# Altium schematic sheet 12_Supply.SchDoc: 12V Supply
size Tabloid; DocumentNumber: LM-008; Revision: B; SheetNumber: 4; SheetTotal: 7
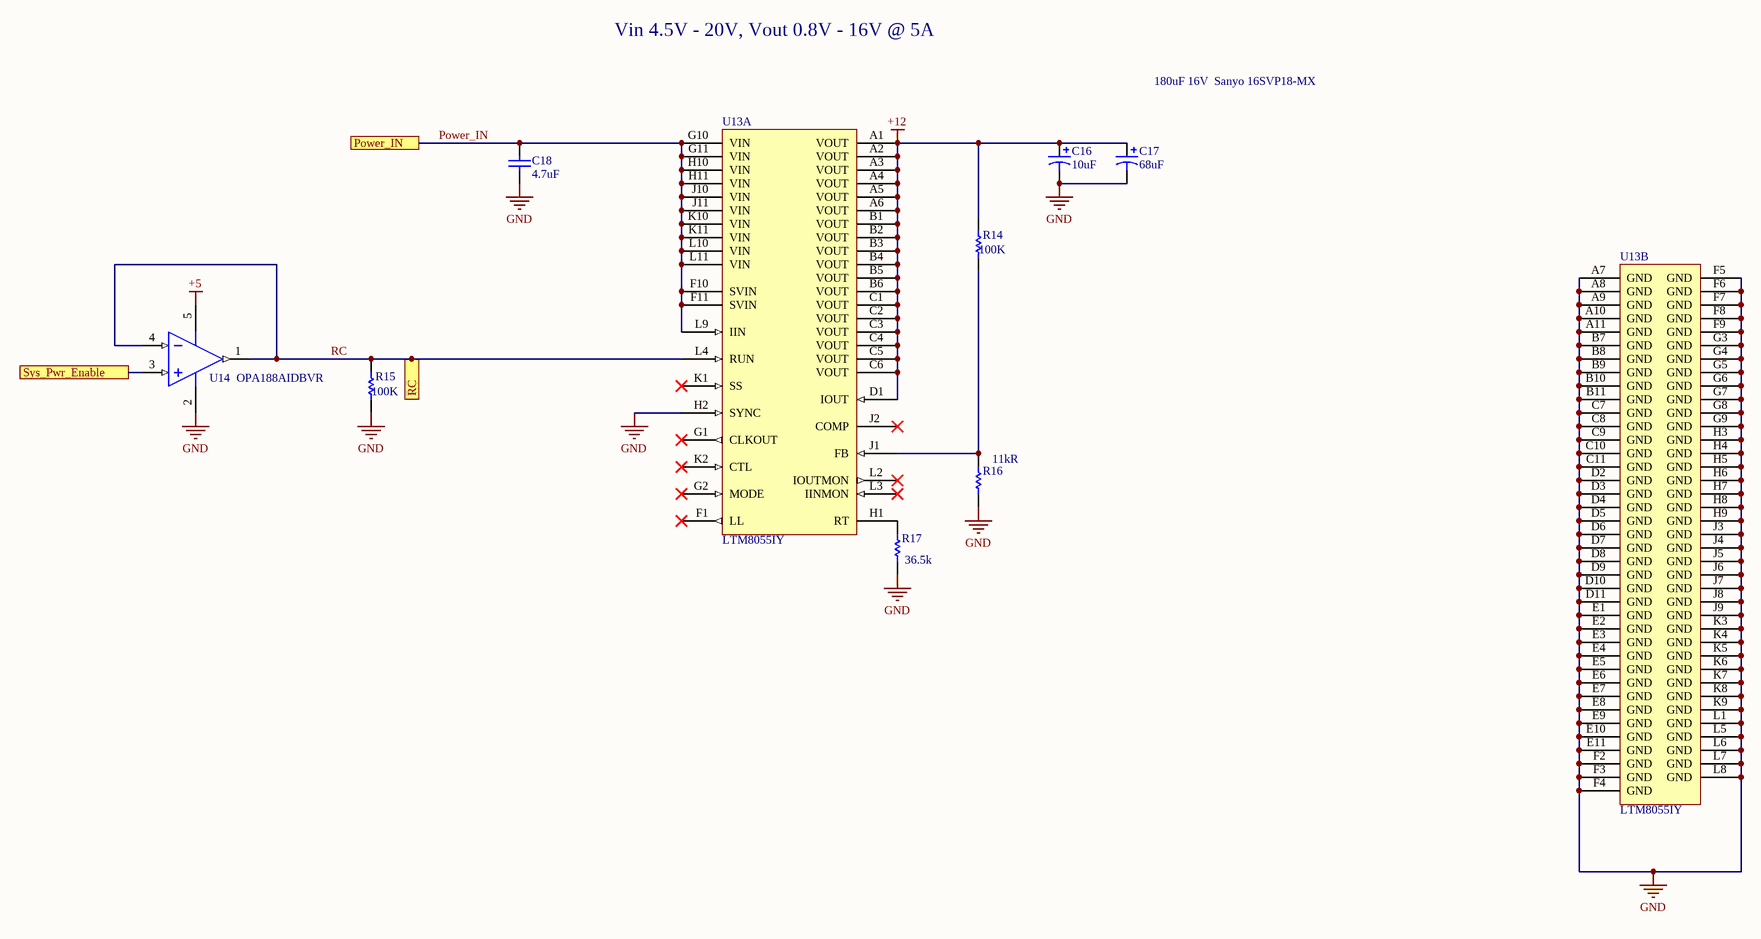
[diagram p0: 12_Supply.SchDoc]

## Parts
C16  10uF  [C0805]
C17  68uF  [AVX-CAPC7343_V]
C18  4.7uF  [CAPC1210(3225)100_M]
R14  Resistance: 100K  [RESC0805(2012)_M]  (hidden comment: RES SMD 100K OHM 1% 1/8W 0805)
R15  Resistance: 100K  [RESC0805(2012)_M]  (hidden comment: RES SMD 100K OHM 1% 1/8W 0805)
R16  Resistance: 11kR  [RESC0805(2012)_M]  (hidden comment: RES SMD 11K OHM 1% 1/8W 0805)
R17  Resistance: 36.5k  [RESC0805(2012)_M]  (hidden comment: RES SMD 35K OHM 1% 1/8W 0805)
U13  LTM8055IY  [LT-BGA-121-15000X15000X4920]  (parts A,B of 2)
U14  OPA188AIDBVR  [DBV0005A_M]

## Ports
Power_IN, RC, Sys_Pwr_Enable

## Nets
+5: U14.5(V+)
+12: C16.1 C17.1 R14.1 U13.A1(VOUT) U13.A2(VOUT) U13.A3(VOUT) U13.A4(VOUT) U13.A5(VOUT) U13.A6(VOUT) U13.B1(VOUT) U13.B2(VOUT) U13.B3(VOUT) U13.B4(VOUT) U13.B5(VOUT) U13.B6(VOUT) U13.C1(VOUT) U13.C2(VOUT) U13.C3(VOUT) U13.C4(VOUT) U13.C5(VOUT) U13.C6(VOUT) U13.D1(IOUT)
GND: C16.2 C17.2 C18.1 R15.2 R16.2 R17.2 U13.A7(GND) U13.A8(GND) U13.A9(GND) U13.A10(GND) U13.A11(GND) U13.B7(GND) U13.B8(GND) U13.B9(GND) U13.B10(GND) U13.B11(GND) U13.C7(GND) U13.C8(GND) U13.C9(GND) U13.C10(GND) U13.C11(GND) U13.D2(GND) U13.D3(GND) U13.D4(GND) U13.D5(GND) U13.D6(GND) U13.D7(GND) U13.D8(GND) U13.D9(GND) U13.D10(GND) U13.D11(GND) U13.E1(GND) U13.E2(GND) U13.E3(GND) U13.E4(GND) U13.E5(GND) U13.E6(GND) U13.E7(GND) U13.E8(GND) U13.E9(GND) U13.E10(GND) U13.E11(GND) U13.F2(GND) U13.F3(GND) U13.F4(GND) U13.F5(GND) U13.F6(GND) U13.F7(GND) U13.F8(GND) U13.F9(GND) U13.G3(GND) U13.G4(GND) U13.G5(GND) U13.G6(GND) U13.G7(GND) U13.G8(GND) U13.G9(GND) U13.H2(SYNC) U13.H3(GND) U13.H4(GND) U13.H5(GND) U13.H6(GND) U13.H7(GND) U13.H8(GND) U13.H9(GND) U13.J3(GND) U13.J4(GND) U13.J5(GND) U13.J6(GND) U13.J7(GND) U13.J8(GND) U13.J9(GND) U13.K3(GND) U13.K4(GND) U13.K5(GND) U13.K6(GND) U13.K7(GND) U13.K8(GND) U13.K9(GND) U13.L1(GND) U13.L5(GND) U13.L6(GND) U13.L7(GND) U13.L8(GND) U14.2(V-)
Power_IN: C18.2 U13.F10(SVIN) U13.F11(SVIN) U13.G10(VIN) U13.G11(VIN) U13.H10(VIN) U13.H11(VIN) U13.J10(VIN) U13.J11(VIN) U13.K10(VIN) U13.K11(VIN) U13.L9(IIN) U13.L10(VIN) U13.L11(VIN) ; port Power_IN
RC: R15.1 U13.L4(RUN) U14.1(OUT) U14.4(IN-) ; port RC
Sys_Pwr_Enable: U14.3(IN+) ; port Sys_Pwr_Enable
NetR14_2: R14.2 R16.1 U13.J1(FB)
NetR17_1: R17.1 U13.H1(RT)

Not connected (* = marked no-connect by the designer): U13 F1(LL)* G1(CLKOUT)* G2(MODE)* J2(COMP)* K1(SS)* K2(CTL)* L2(IOUTMON)* L3(IINMON)*

## Notes on the sheet
- Vin 4.5V - 20V, Vout 0.8V - 16V @ 5A
- 180uF 16V  Sanyo 16SVP18-MX
- Title
- Size:
- Date:
- Tabloid
- Number:
- Time:
- Revision:
- Sheet
- of
- ZLS Corporation
- 7801 North Lamar Blvd.
- Suite E-184
- Austin, Texas 78752  USA
- (512) 453-0288
- File:

## Library data of the parts
C16 = Cap Pol3: Polarized Capacitor (Surface Mount)
C17 = CMP-0279-00002-2: CAP TANT POLY 68UF 25V 2917; Manufacturer: Kyocera AVX; Manufacturer Part Number: TCJE686M025R0050; Tolerance: 20%; ESR (Equivalent Series Resistance): 50mR; Leakage Current: 170uA; Life (Hours): 2000Hour; Dissipation Factor: 6%; ComponentLink2Description: Datasheet; ComponentLink2URL: http://www.avx.com/docs/Catalogs/taj.pdf; ComponentLink1URL: http://www.avx.com/; ComponentLink1Description: Manufacturer URL; Supplier 1: Digi-Key; Supplier Part Number 1: 478-9471-6-ND; Stock 1: 439; Pricing 1: 1=3.92, 10=3.163, 100=2.4672 (USD); Mount: Surface Mount; Case/Package: 2917; Case Code (Imperial): 2917; Case Code (Metric): 7343; Min Operating Temperature: -55°C; Max Operating Temperature: 105°C; Capacitance: 68uF; Voltage Rating: 25V; Packaging: Tape and Reel; Package Quantity: 400; Voltage Rating (DC): 25V; Termination: SMD/SMT; Features: General Purpose; Length: 7.3mm; Height: 4.3mm; Width: 0.169inch; Height - Seated (Max): 0.169inch; Depth: 4.3mm; Radiation Hardening: No; ComponentLink3URL: http://www.avx.com/docs/catalogs/tcj.pdf?src-supplier=Avnet; ComponentLink3Description: http://www.avx.com/docs/catalogs/tcj.pdf?src-supplier=Avnet
C18 = CMP-1038-00619-1: CAP CER 4.7UF 50V X7R 1210; Manufacturer: Murata; Manufacturer Part Number: GCM32ER71H475KA55K; Tolerance: 10%; Supplier 1: Digi-Key; Supplier Part Number 1: 490-8066-6-ND; Stock 1: 63504; Pricing 1: 1=1.8, 10=1.424, 100=1.0676, 500=0.80666, 1000=0.71177 (USD); Mount: Surface Mount; Case/Package: 1210; Case Code (Metric): 3225; Case Code (Imperial): 1210; Min Operating Temperature: -55°C; Max Operating Temperature: 125°C; Capacitance: 4.7uF; Packaging: Tape and Reel; Package Quantity: 1; Voltage Rating: 50V; Voltage Rating (DC): 50V; Dielectric: X7R; Termination: SMD/SMT; Length: 3.2mm; Height: 2.5mm; Width: 0.098inch; Thickness: 0.106inch; Depth: 2.5mm; Ratings: AEC-Q200; Radiation Hardening: No; ComponentLink1URL: http://search.murata.co.jp/Ceramy/image/img/A01X/partnumbering_e_02.pdf?src-supplier=Digi-Key; ComponentLink1Description: http://search.murata.co.jp/Ceramy/image/img/A01X/partnumbering_e_02.pdf?src-supplier=Digi-Key; ComponentLink2URL: http://psearch.en.murata.com/capacitor/product/GCM32ER71H475KA55%23.pdf?src-supplier=Digi-Key; ComponentLink2Description: http://psearch.en.murata.com/capacitor/product/GCM32ER71H475KA55%23.pdf?src-supplier=Digi-Key; ComponentLink3URL: http://psearch.murata.com/capacitor/product/GCM32ER71H475KA55%23.pdf?src-supplier=Avnet; ComponentLink3Description: http://psearch.murata.com/capacitor/product/GCM32ER71H475KA55%23.pdf?src-supplier=Avnet
R14 R15 = CMP-1013-00017-1: Manufacturer: Vishay; Manufacturer Part Number: CRCW0805100KFKEA; Temperature Coefficient: 100ppm/°C; Power Rating: 125mW; Voltage Rating: 150V; Supplier 1: Avnet; Supplier Part Number 1: CRCW0805100KFKEA/BKN; Stock 1: 1317; Pricing 1: 1=0.1, 10=0.049, 25=0.042, 50=0.035, 100=0.028 (USD); Mount: Surface Mount; Case/Package: 0805; Number of Pins: 2; Weight: 0.000194oz; Contact Plating: Tin; Case Code (Imperial): 0805; Case Code (Metric): 2012; Min Operating Temperature: -55°C; Max Operating Temperature: 155°C; Tolerance: 1%; Composition: Thick Film; Termination: SMD/SMT; Packaging: Tape and Reel; Package Quantity: 5000; Military Standard: Not; Voltage Rating (DC): 150V; Length: 2mm; Height: 0.45mm; Width: 1.25mm; Depth: 1.25mm; Radiation Hardening: No; Lead Free: Lead Free; REACH SVHC: Unknown; ComponentLink1URL: https://datasheet.ciiva.com/11809/0900766b80d98b26-11809057.pdf; ComponentLink1Description: https://datasheet.ciiva.com/11809/0900766b80d98b26-11809057.pdf; ComponentLink2URL: https://datasheet.ciiva.com/7777/1697337-7777349.pdf; ComponentLink2Description: https://datasheet.ciiva.com/7777/1697337-7777349.pdf; ComponentLink3URL: https://datasheet.ciiva.com/3258/dcrcwe3-3258006.pdf; ComponentLink3Description: https://datasheet.ciiva.com/3258/dcrcwe3-3258006.pdf; ComponentLink4URL: https://datasheet.ciiva.com/16754/70201119-16754822.pdf; ComponentLink4Description: https://datasheet.ciiva.com/16754/70201119-16754822.pdf; ComponentLink5URL: https://datasheet.ciiva.com/8337/dcrcwe3-8337738.pdf; ComponentLink5Description: https://datasheet.ciiva.com/8337/dcrcwe3-8337738.pdf; ComponentLink6URL: https://datasheet.ciiva.com/16341/dcrcwe3-16341530.pdf; ComponentLink6Description: https://datasheet.ciiva.com/16341/dcrcwe3-16341530.pdf; ComponentLink7URL: https://datasheet.ciiva.com/16852/dcrcwe3-16852810.pdf; ComponentLink7Description: https://datasheet.ciiva.com/16852/dcrcwe3-16852810.pdf; ComponentLink8URL: https://datasheet.ciiva.com/16720/70201119-16720891.pdf; ComponentLink8Description: https://datasheet.ciiva.com/16720/70201119-16720891.pdf; ComponentLink9URL: https://datasheet.ciiva.com/7777/1720486-7777565.pdf; ComponentLink9Description: https://datasheet.ciiva.com/7777/1720486-7777565.pdf
R16 = CMP-1013-00017-1: Manufacturer: TE Connectivity Holsworthy; Manufacturer Part Number: CRG0805F11K; Temperature Coefficient: 100ppm/°C; Power Rating: 125mW; Voltage Rating: 150V; Number of Resistors: 1; ComponentLink1URL: https://datasheet.ciiva.com/11809/0900766b80d98b26-11809057.pdf; ComponentLink1Description: https://datasheet.ciiva.com/11809/0900766b80d98b26-11809057.pdf; ComponentLink2URL: https://datasheet.ciiva.com/7777/1697337-7777349.pdf; ComponentLink2Description: https://datasheet.ciiva.com/7777/1697337-7777349.pdf; ComponentLink3URL: https://datasheet.ciiva.com/3258/dcrcwe3-3258006.pdf; ComponentLink3Description: https://datasheet.ciiva.com/3258/dcrcwe3-3258006.pdf; ComponentLink4URL: https://datasheet.ciiva.com/16754/70201119-16754822.pdf; ComponentLink4Description: https://datasheet.ciiva.com/16754/70201119-16754822.pdf; ComponentLink5URL: https://datasheet.ciiva.com/8337/dcrcwe3-8337738.pdf; ComponentLink5Description: https://datasheet.ciiva.com/8337/dcrcwe3-8337738.pdf; ComponentLink6URL: https://datasheet.ciiva.com/16341/dcrcwe3-16341530.pdf; ComponentLink6Description: https://datasheet.ciiva.com/16341/dcrcwe3-16341530.pdf; ComponentLink7URL: https://datasheet.ciiva.com/16852/dcrcwe3-16852810.pdf; ComponentLink7Description: https://datasheet.ciiva.com/16852/dcrcwe3-16852810.pdf; ComponentLink8URL: https://datasheet.ciiva.com/16720/70201119-16720891.pdf; ComponentLink8Description: https://datasheet.ciiva.com/16720/70201119-16720891.pdf; ComponentLink9URL: https://datasheet.ciiva.com/7777/1720486-7777565.pdf; ComponentLink9Description: https://datasheet.ciiva.com/7777/1720486-7777565.pdf; Supplier 1: Digikey; Supplier Part Number 1: A126334DKR-ND; Stock 1: 142510; Pricing 1: 1=0.1, 10=0.052, 100=0.021, 1000=0.00943, 2500=0.00819 (USD); Mount: Surface Mount; Case/Package: 0805; Weight: 0.000194oz; Case Code (Imperial): 0805; Case Code (Metric): 2012; Min Operating Temperature: -55°C; Max Operating Temperature: 125°C; Tolerance: 1%; Packaging: Tape and Reel; Composition: Thick Film; Package Quantity: 5000; Number of Terminations: 2; Termination: Solder; Length: 2mm; Height: 0.55mm; Width: 1.25mm; ELV: Compliant; ComponentLink10URL: http://www.mouser.com/ds/2/418/NG_CD_1623104_BA-655654.pdf?src-supplier=Mouser; ComponentLink10Description: http://www.mouser.com/ds/2/418/NG_CD_1623104_BA-655654.pdf?src-supplier=Mouser
R17 = CMP-1013-00017-1: Manufacturer: Vishay; Manufacturer Part Number: CRCW080536K5FKEA; Temperature Coefficient: 100ppm/°C; Max Power Dissipation: 125mW; Voltage Rating: 150V; ComponentLink1URL: https://datasheet.ciiva.com/11809/0900766b80d98b26-11809057.pdf; ComponentLink1Description: https://datasheet.ciiva.com/11809/0900766b80d98b26-11809057.pdf; ComponentLink2URL: https://datasheet.ciiva.com/7777/1697337-7777349.pdf; ComponentLink2Description: https://datasheet.ciiva.com/7777/1697337-7777349.pdf; ComponentLink3URL: https://datasheet.ciiva.com/3258/dcrcwe3-3258006.pdf; ComponentLink3Description: https://datasheet.ciiva.com/3258/dcrcwe3-3258006.pdf; ComponentLink4URL: https://datasheet.ciiva.com/16754/70201119-16754822.pdf; ComponentLink4Description: https://datasheet.ciiva.com/16754/70201119-16754822.pdf; ComponentLink5URL: https://datasheet.ciiva.com/8337/dcrcwe3-8337738.pdf; ComponentLink5Description: https://datasheet.ciiva.com/8337/dcrcwe3-8337738.pdf; ComponentLink6URL: https://datasheet.ciiva.com/16341/dcrcwe3-16341530.pdf; ComponentLink6Description: https://datasheet.ciiva.com/16341/dcrcwe3-16341530.pdf; ComponentLink7URL: https://datasheet.ciiva.com/16852/dcrcwe3-16852810.pdf; ComponentLink7Description: https://datasheet.ciiva.com/16852/dcrcwe3-16852810.pdf; ComponentLink8URL: https://datasheet.ciiva.com/16720/70201119-16720891.pdf; ComponentLink8Description: https://datasheet.ciiva.com/16720/70201119-16720891.pdf; ComponentLink9URL: https://datasheet.ciiva.com/7777/1720486-7777565.pdf; ComponentLink9Description: https://datasheet.ciiva.com/7777/1720486-7777565.pdf; ComponentLink10URL: http://www.mouser.com/ds/2/418/NG_CD_1623104_BA-655654.pdf?src-supplier=Mouser; ComponentLink10Description: http://www.mouser.com/ds/2/418/NG_CD_1623104_BA-655654.pdf?src-supplier=Mouser; Supplier 1: Digi-Key; Supplier Part Number 1: 541-36.5KCDKR-ND; Stock 1: 56622; Pricing 1: 1=0.1, 10=0.069, 100=0.028, 1000=0.01256, 2500=0.0109 (USD); Case/Package: 0805; Number of Pins: 2; Weight: 0.000194oz; Contact Plating: Tin; Case Code (Imperial): 0805; Case Code (Metric): 2012; Min Operating Temperature: -55°C; Max Operating Temperature: 155°C; Tolerance: 1%; Composition: Thick Film; Packaging: Tape and Reel; Package Quantity: 10; Number of Terminations: 2; Features: Automotive AEC-Q200; Power Rating: 125mW; Military Standard: Not; Termination: SMD/SMT; Length: 2mm; Height: 0.45mm; Width: 1.25mm; Depth: 1.25mm; Radiation Hardening: No; REACH SVHC: Unknown; ComponentLink11URL: http://uk.rs-online.com/webdocs/0d98/0900766b80d98b26.pdf?src-supplier=RSComponents; ComponentLink11Description: http://uk.rs-online.com/webdocs/0d98/0900766b80d98b26.pdf?src-supplier=RSComponents; ComponentLink12URL: https://www.verical.com/server-webapp/html/getDatasheet?partID=32738&src-supplier=Verical; ComponentLink12Description: https://www.verical.com/server-webapp/html/getDatasheet?partID=32738&src-supplier=Verical; ComponentLink13URL: http://www.farnell.com/datasheets/1697337.pdf?src-supplier=Farnell; ComponentLink13Description: http://www.farnell.com/datasheets/1697337.pdf?src-supplier=Farnell; ComponentLink14URL: http://www.vishay.com/docs/20035/dcrcwe3.pdf?src-supplier=Avnet; ComponentLink14Description: http://www.vishay.com/docs/20035/dcrcwe3.pdf?src-supplier=Avnet; ComponentLink15URL: http://www.farnell.com/datasheets/2111203.pdf?src-supplier=Element14; ComponentLink15Description: http://www.farnell.com/datasheets/2111203.pdf?src-supplier=Element14; ComponentLink16URL: https://www.alliedelec.com/m/d/0c934d6939ccefa68dbe0b96d821c8cf.pdf?src-supplier=Allied+Electronics; ComponentLink16Description: https://www.alliedelec.com/m/d/0c934d6939ccefa68dbe0b96d821c8cf.pdf?src-supplier=Allied+Electronics; ComponentLink17URL: http://www.vishay.com/docs/20035/dcrcwe3.pdf?src-supplier=Digi-Key; ComponentLink17Description: http://www.vishay.com/docs/20035/dcrcwe3.pdf?src-supplier=Digi-Key; ComponentLink18URL: http://www.farnell.com/datasheets/2049244.pdf?src-supplier=Element14; ComponentLink18Description: http://www.farnell.com/datasheets/2049244.pdf?src-supplier=Element14; ComponentLink19URL: http://www.vishay.com/docs/20035/dcrcwe3.pdf?src-supplier=Avnet+Europe; ComponentLink19Description: http://www.vishay.com/docs/20035/dcrcwe3.pdf?src-supplier=Avnet+Europe
U13 = CMP-2000-06614-1: Buck-Boost uModule Regulator, 8.5 A, 5 to 36 V, -40 to 125 degC, 121-Ball BGA, RoHS, Tray; Manufacturer: LinearTechnology; Current - Output (Max): 8.5A; Number of Outputs: 1; Efficiency: 97.5%; Voltage - Input (Max): 36V; Package Version: Rev. A, 11/2012; Voltage - Output 1: 1.2~36V; Voltage - Input (Min): 5V; Operating Temperature: -40°C~125°C; Voltage - Output 3: -; Datasheet Version: Rev. A, 01/2016; Power (Watts) - Manufacture Series: -; Series: µModule®; Manufacturer URL: http://www.linear.com/; Datasheet URL: http://cds.linear.com/docs/en/datasheet/8055fa.pdf; Type: Non-IsolatedPoLModule; Voltage - Output 2: -; Mounting Type: SurfaceMount; Packaging: Tray; Mounting Technology: SurfaceMount; Package URL: http://www.linear.com/docs/41075; Features: OTP; Power (Watts) - Max: -; Package Reference: BGA-121; Category: PowerSupplies-BoardMount; Package / Case: 121-BGA; Voltage - Isolation: -; Package Description: 121-Ball BGA, Body 15 x 15 mm, Pitch 1.27 mm; Applications: ITE(Commercial); Family: DCDCConverters; PartId: 1
U14 = CMP-0809-00005-2: Precision, Low Noise, Rail-to-Rail Output, Zero-Drift Operational Amplifier, 4 to 36 V, -40 to 125 degC, 5-pin SOT23 (DBV5), Green (RoHS & no Sb/Br); Manufacturer: Texas Instruments; Slew Rate: 0.8 V/µs; Current - Supply: 450µA; Voltage - Supply, Single/Dual (±): 4 V ~ 36 V, ±2 V ~ 18 V; Supplier 1: Digi-Key; Supplier Part Number 1: 296-40438-1-ND; Manufacturer Part Number: OPA188AIDBVR; RoHS: RoHS Compliant; Category: Integrated Circuits (ICs); Stock 1: 1779; Pricing 1: 1=2.46, 10=2.211, 100=1.7771, 500=1.46002, 1000=1.20974 (USD); Packaging: Cut Tape (CT); Part Status: Active; Amplifier Type: Zero-Drift; Output Type: Rail-to-Rail; Operating Temperature: -40°C ~ 125°C; Mounting Type: Surface Mount; Package / Case: SC-74A, SOT-753; Supplier Device Package: SOT-23-5; ComponentLink1URL: http://www.ti.com/lit/ds/symlink/opa188.pdf; ComponentLink1Description: http://www.ti.com/lit/ds/symlink/opa188.pdf